# EAGLE schematic Motor Driver Board (EAGLE 9.3.2)
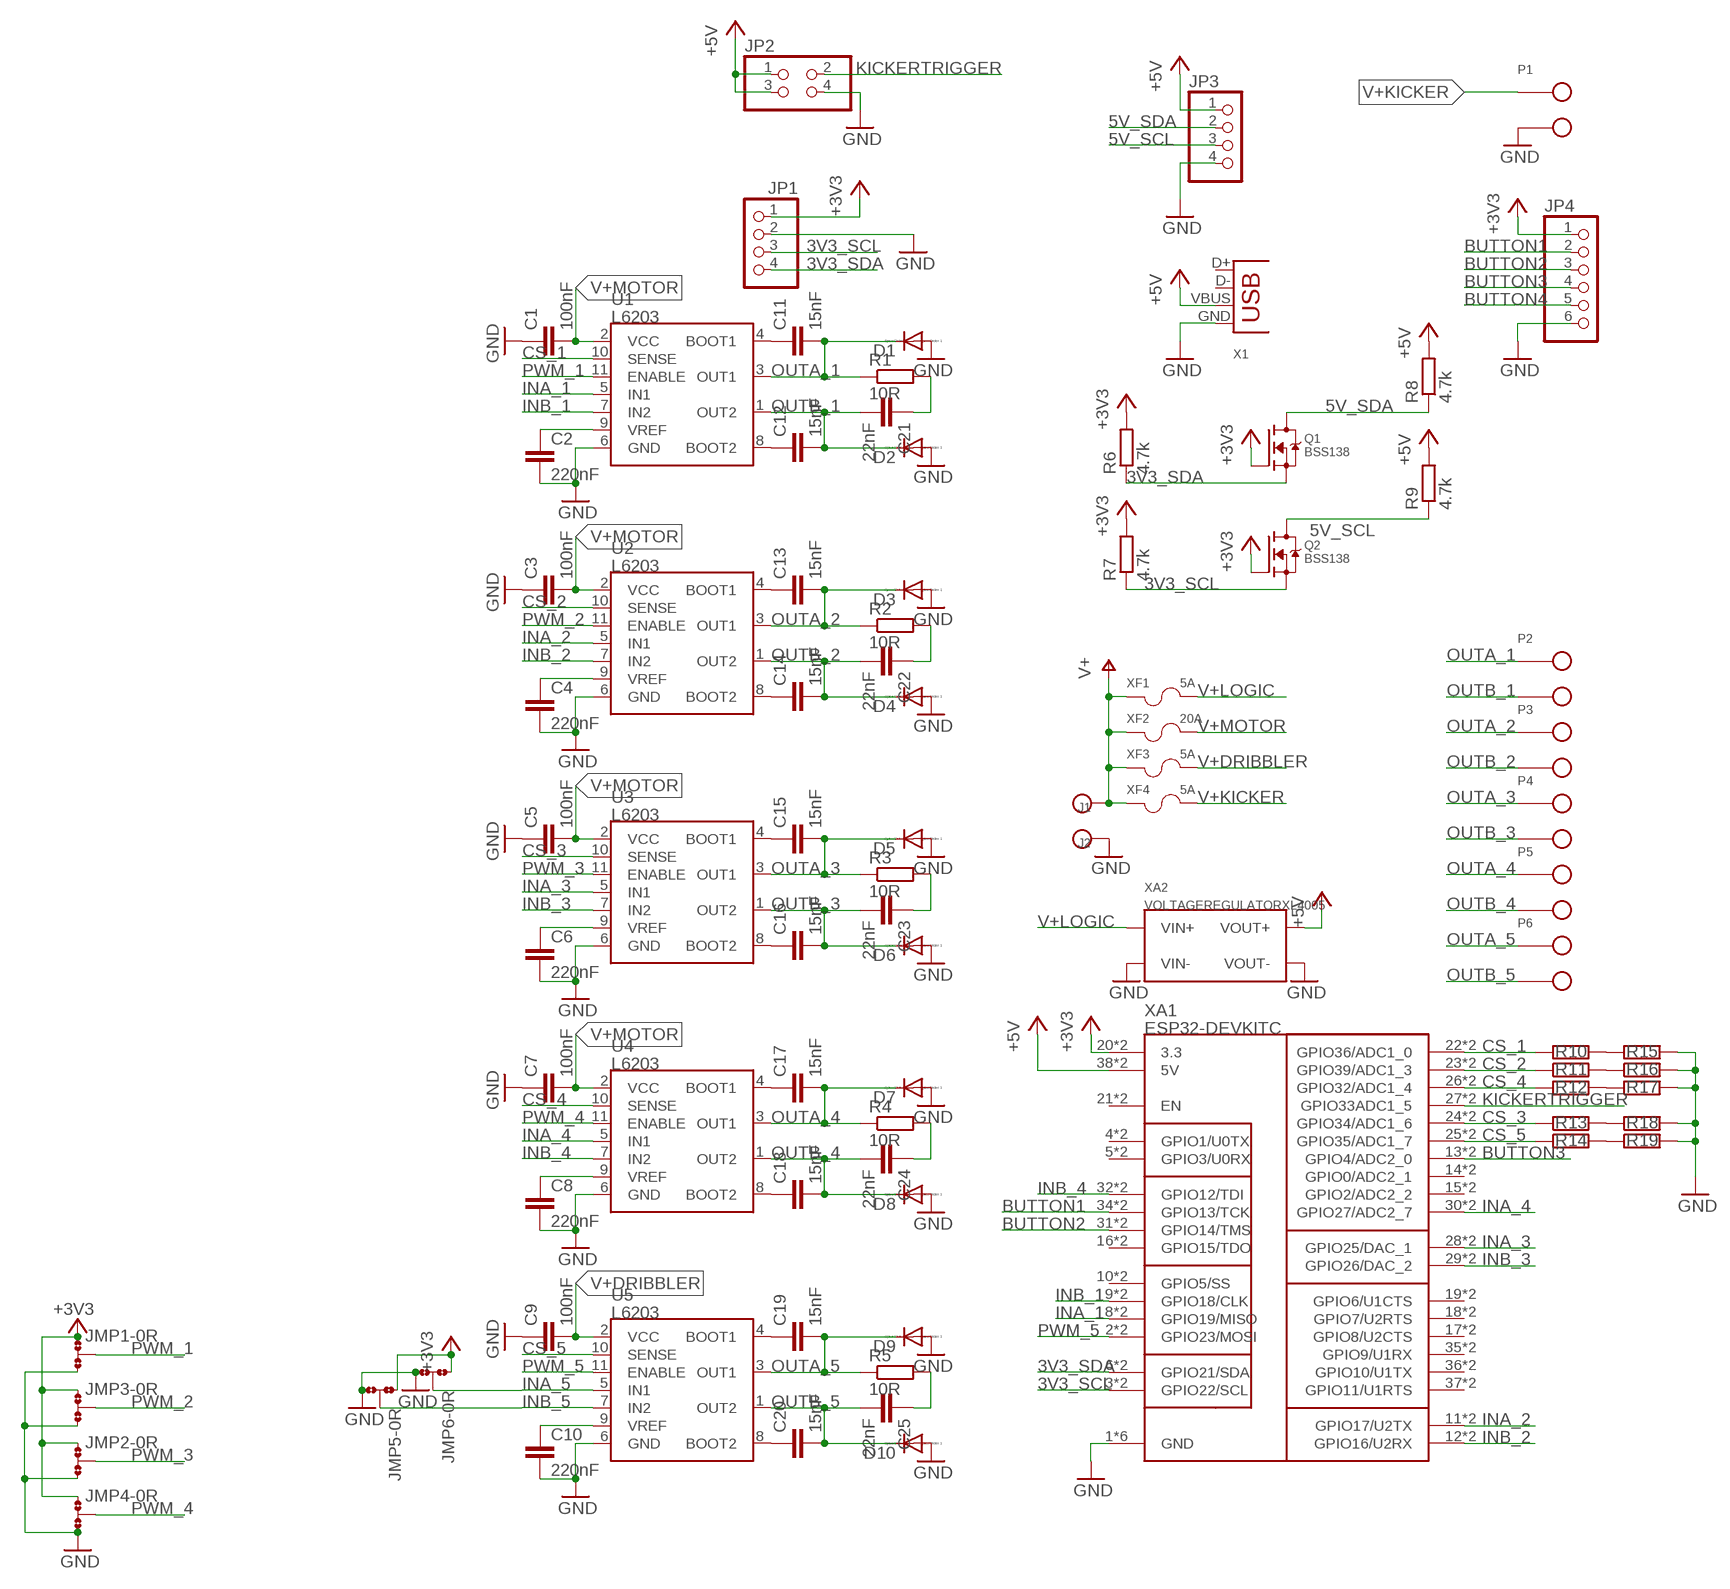
[diagram p0: schematic, sheet 1]

## Parts
C1  100nF  C-EUC0805  [C0805]
C2  220nF  C-EUC0805  [C0805]
C3  100nF  C-EUC0805  [C0805]
C4  220nF  C-EUC0805  [C0805]
C5  100nF  C-EUC0805  [C0805]
C6  220nF  C-EUC0805  [C0805]
C7  100nF  C-EUC0805  [C0805]
C8  220nF  C-EUC0805  [C0805]
C9  100nF  C-EUC0805  [C0805]
C10  220nF  C-EUC0805  [C0805]
C11  15nF  C-EUC0805  [C0805]
C12  15nF  C-EUC0805  [C0805]
C13  15nF  C-EUC0805  [C0805]
C14  15nF  C-EUC0805  [C0805]
C15  15nF  C-EUC0805  [C0805]
C16  15nF  C-EUC0805  [C0805]
C17  15nF  C-EUC0805  [C0805]
C18  15nF  C-EUC0805  [C0805]
C19  15nF  C-EUC0805  [C0805]
C20  15nF  C-EUC0805  [C0805]
C21  22nF  C-EUC0805  [C0805]
C22  22nF  C-EUC0805  [C0805]
C23  22nF  C-EUC0805  [C0805]
C24  22nF  C-EUC0805  [C0805]
C25  22nF  C-EUC0805  [C0805]
D1  DIODE-DO214AA  [DO214AA]
D2  DIODE-DO214AA  [DO214AA]
D3  DIODE-DO214AA  [DO214AA]
D4  DIODE-DO214AA  [DO214AA]
D5  DIODE-DO214AA  [DO214AA]
D6  DIODE-DO214AA  [DO214AA]
D7  DIODE-DO214AA  [DO214AA]
D8  DIODE-DO214AA  [DO214AA]
D9  DIODE-DO214AA  [DO214AA]
D10  DIODE-DO214AA  [DO214AA]
J1  MOLEXQUICKCONNECT  [MOLEXQUICKCONNECT]
J2  MOLEXQUICKCONNECT  [MOLEXQUICKCONNECT]
JMP1  0R-JUMPA  [A0R-JMP]
JMP2  0R-JUMPA  [A0R-JMP]
JMP3  0R-JUMPA  [A0R-JMP]
JMP4  0R-JUMPA  [A0R-JMP]
JMP5  0R-JUMPA  [A0R-JMP]
JMP6  0R-JUMPA  [A0R-JMP]
JP1  PINHD-1X4  [1X04]
JP2  PINHD-2X2  [2X02]
JP3  PINHD-1X4  [1X04]
JP4  PINHD-1X6  [1X06]
P1  TERMINALBLOCK0.15"  [TERMINALBLOCK0.15"]
P2  TERMINALBLOCK0.15"  [TERMINALBLOCK0.15"]
P3  TERMINALBLOCK0.15"  [TERMINALBLOCK0.15"]
P4  TERMINALBLOCK0.15"  [TERMINALBLOCK0.15"]
P5  TERMINALBLOCK0.15"  [TERMINALBLOCK0.15"]
P6  TERMINALBLOCK0.15"  [TERMINALBLOCK0.15"]
Q1  BSS138  [SOT95P240X120-3N]
Q2  BSS138  [SOT95P240X120-3N]
R1  10R  R-EU_R0805  [R0805]
R2  10R  R-EU_R0805  [R0805]
R3  10R  R-EU_R0805  [R0805]
R4  10R  R-EU_R0805  [R0805]
R5  10R  R-EU_R0805  [R0805]
R6  4.7k  R-EU_R0805  [R0805]
R7  4.7k  R-EU_R0805  [R0805]
R8  4.7k  R-EU_R0805  [R0805]
R9  4.7k  R-EU_R0805  [R0805]
R10  R-EU_R2512  [R2512]
R11  R-EU_R2512  [R2512]
R12  R-EU_R2512  [R2512]
R13  R-EU_R2512  [R2512]
R14  R-EU_R2512  [R2512]
R15  R-EU_R2512  [R2512]
R16  R-EU_R2512  [R2512]
R17  R-EU_R2512  [R2512]
R18  R-EU_R2512  [R2512]
R19  R-EU_R2512  [R2512]
U1  L6203  [MULTIWATT-11]
U2  L6203  [MULTIWATT-11]
U3  L6203  [MULTIWATT-11]
U4  L6203  [MULTIWATT-11]
U5  L6203  [MULTIWATT-11]
X1  USB-A-H  [USB-A-H]
XA1  ESP32-DEVKITC  [ESP32_DEVKITC]
XA2  VOLTAGEREGULATORXL4005  [XL4005PCB]
XF1  5A  FUSE  [MINIFUSEHOLDER]
XF2  20A  FUSE  [MINIFUSEHOLDER]
XF3  5A  FUSE  [MINIFUSEHOLDER]
XF4  5A  FUSE  [MINIFUSEHOLDER]

## Nets
3V3_SCL: JP1.3 Q2.2(S) R7.1 XA1.3(GPIO22/SCL) XA1.43(GPIO22/SCL)
3V3_SDA: JP1.4 Q1.2(S) R6.1 XA1.6(GPIO21/SDA) XA1.46(GPIO21/SDA)
5V_SCL: JP3.3 Q2.3(D) R9.1
5V_SDA: JP3.2 Q1.3(D) R8.1
+3V3: JMP1.1 JMP2.1 JMP3.1 JMP4.1 JMP5.1 JMP6.1 JP1.1 JP4.1 Q1.1(G) Q2.1(G) R6.2 R7.2 XA1.20(3.3) XA1.60(3.3)
+5V: JP2.1 JP2.3 JP3.1 R8.2 R9.2 X1.VBUS XA1.38(5V) XA1.78(5V) XA2.OUT+(VOUT+) XA2.OUT+THT(VOUT+)
ACSYNC_1: C21.1 R1.2
ACSYNC_2: C22.1 R2.2
ACSYNC_3: C23.1 R3.2
ACSYNC_4: C24.1 R4.2
ACSYNC_5: C25.1 R5.2
BOOTA_1: C11.1 U1.4(BOOT1)
BOOTA_2: C13.1 U2.4(BOOT1)
BOOTA_3: C15.1 U3.4(BOOT1)
BOOTA_4: C17.1 U4.4(BOOT1)
BOOTA_5: C19.1 U5.4(BOOT1)
BOOTB_1: C12.1 U1.8(BOOT2)
BOOTB_2: C14.1 U2.8(BOOT2)
BOOTB_3: C16.1 U3.8(BOOT2)
BOOTB_4: C18.1 U4.8(BOOT2)
BOOTB_5: C20.1 U5.8(BOOT2)
BUTTON1: JP4.2 XA1.34(GPIO13/TCK) XA1.74(GPIO13/TCK)
BUTTON2: JP4.3 XA1.31(GPIO14/TMS) XA1.71(GPIO14/TMS)
BUTTON3: JP4.4 XA1.13(GPIO4/ADC2_0) XA1.53(GPIO4/ADC2_0)
BUTTON4: JP4.5
CS_1: R10.1 U1.10(SENSE) XA1.22(GPIO36/ADC1_0) XA1.62(GPIO36/ADC1_0)
CS_2: R11.1 U2.10(SENSE) XA1.23(GPIO39/ADC1_3) XA1.63(GPIO39/ADC1_3)
CS_3: R13.1 U3.10(SENSE) XA1.24(GPIO34/ADC1_6) XA1.64(GPIO34/ADC1_6)
CS_4: R12.1 U4.10(SENSE) XA1.26(GPIO32/ADC1_4) XA1.66(GPIO32/ADC1_4)
CS_5: R14.1 U5.10(SENSE) XA1.25(GPIO35/ADC1_7) XA1.65(GPIO35/ADC1_7)
GND: C1.1 C2.2 C3.1 C4.2 C5.1 C6.2 C7.1 C8.2 C9.1 C10.2 D1.A D2.A D3.A D4.A D5.A D6.A D7.A D8.A D9.A D10.A J2.P$1 J2.P$3 J2.P$4 JMP1.3 JMP2.3 JMP3.3 JMP4.3 JMP5.3 JMP6.3 JP1.2 JP2.4 JP3.4 JP4.6 P1.P$2(PIN2) R15.2 R16.2 R17.2 R18.2 R19.2 U1.6(GND) U2.6(GND) U3.6(GND) U4.6(GND) U5.6(GND) X1.GND XA1.1(GND) XA1.7(GND) XA1.33(GND) XA1.41(GND) XA1.47(GND) XA1.73(GND) XA2.IN-(VIN-) XA2.IN-THT(VIN-) XA2.OUT-(VOUT-) XA2.OUT-THT(VOUT-)
INA_1: U1.5(IN1) XA1.8(GPIO19/MISO) XA1.48(GPIO19/MISO)
INA_2: U2.5(IN1) XA1.11(GPIO17/U2TX) XA1.51(GPIO17/U2TX)
INA_3: U3.5(IN1) XA1.28(GPIO25/DAC_1) XA1.68(GPIO25/DAC_1)
INA_4: U4.5(IN1) XA1.30(GPIO27/ADC2_7) XA1.70(GPIO27/ADC2_7)
INA_5: JMP6.2 U5.5(IN1)
INB_1: U1.7(IN2) XA1.9(GPIO18/CLK) XA1.49(GPIO18/CLK)
INB_2: U2.7(IN2) XA1.12(GPIO16/U2RX) XA1.52(GPIO16/U2RX)
INB_3: U3.7(IN2) XA1.29(GPIO26/DAC_2) XA1.69(GPIO26/DAC_2)
INB_4: U4.7(IN2) XA1.32(GPIO12/TDI) XA1.72(GPIO12/TDI)
INB_5: JMP5.2 U5.7(IN2)
KICKERTRIGGER: JP2.2 XA1.27(GPIO33ADC1_5) XA1.67(GPIO33ADC1_5)
N$1: R10.2 R15.1
N$2: R11.2 R16.1
N$3: R12.2 R17.1
N$4: R13.2 R18.1
N$5: R14.2 R19.1
OUTA_1: C11.2 D1.C P2.P$1(PIN1) R1.1 U1.3(OUT1)
OUTA_2: C13.2 D3.C P3.P$1(PIN1) R2.1 U2.3(OUT1)
OUTA_3: C15.2 D5.C P4.P$1(PIN1) R3.1 U3.3(OUT1)
OUTA_4: C17.2 D7.C P5.P$1(PIN1) R4.1 U4.3(OUT1)
OUTA_5: C19.2 D9.C P6.P$1(PIN1) R5.1 U5.3(OUT1)
OUTB_1: C12.2 C21.2 D2.C P2.P$2(PIN2) U1.1(OUT2)
OUTB_2: C14.2 C22.2 D4.C P3.P$2(PIN2) U2.1(OUT2)
OUTB_3: C16.2 C23.2 D6.C P4.P$2(PIN2) U3.1(OUT2)
OUTB_4: C18.2 C24.2 D8.C P5.P$2(PIN2) U4.1(OUT2)
OUTB_5: C20.2 C25.2 D10.C P6.P$2(PIN2) U5.1(OUT2)
PWM_1: JMP1.2 U1.11(ENABLE)
PWM_2: JMP3.2 U2.11(ENABLE)
PWM_3: JMP2.2 U3.11(ENABLE)
PWM_4: JMP4.2 U4.11(ENABLE)
PWM_5: U5.11(ENABLE) XA1.2(GPIO23/MOSI) XA1.42(GPIO23/MOSI)
V+: J1.P$1 J1.P$3 J1.P$4 XF1.P$1 XF1.P$2 XF2.P$1 XF2.P$2 XF3.P$1 XF3.P$2 XF4.P$1 XF4.P$2
V+DRIBBLER: C9.2 U5.2(VCC) XF3.P$3 XF3.P$4
V+KICKER: P1.P$1(PIN1) XF4.P$3 XF4.P$4
V+LOGIC: XA2.IN+(VIN+) XA2.IN+THT(VIN+) XF1.P$3 XF1.P$4
V+MOTOR: C1.2 C3.2 C5.2 C7.2 U1.2(VCC) U2.2(VCC) U3.2(VCC) U4.2(VCC) XF2.P$3 XF2.P$4
VREF_1: C2.1 U1.9(VREF)
VREF_2: C4.1 U2.9(VREF)
VREF_3: C6.1 U3.9(VREF)
VREF_4: C8.1 U4.9(VREF)
VREF_5: C10.1 U5.9(VREF)
Unconnected: X1.D+ X1.D- XA1.4(GPIO1/U0TX) XA1.5(GPIO3/U0RX) XA1.10(GPIO5/SS) XA1.14(GPIO0/ADC2_1) XA1.15(GPIO2/ADC2_2) XA1.16(GPIO15/TDO) XA1.17(GPIO8/U2CTS) XA1.18(GPIO7/U2RTS) XA1.19(GPIO6/U1CTS) XA1.21(EN) XA1.35(GPIO9/U1RX) XA1.36(GPIO10/U1TX) XA1.37(GPIO11/U1RTS) XA1.44(GPIO1/U0TX) XA1.45(GPIO3/U0RX) XA1.50(GPIO5/SS) XA1.54(GPIO0/ADC2_1) XA1.55(GPIO2/ADC2_2) XA1.56(GPIO15/TDO) XA1.57(GPIO8/U2CTS) XA1.58(GPIO7/U2RTS) XA1.59(GPIO6/U1CTS) XA1.61(EN) XA1.75(GPIO9/U1RX) XA1.76(GPIO10/U1TX) XA1.77(GPIO11/U1RTS)

## Library data of the parts
C1-C25 = rcl:C-EU: CAPACITOR, European symbol; SPICEPREFIX: C
D1-D10 = diode:DIODE-: DIODE
J1 J2 = Robocup:MOLEXQUICKCONNECT
JMP1-JMP6 = jump-0r-smd:0R-JUMP: SMD 0R 0805 Jumper
JP1 JP3 = pinhead:PINHD-1X4: PIN HEADER
JP2 = pinhead:PINHD-2X2: PIN HEADER
JP4 = pinhead:PINHD-1X6: PIN HEADER
P1-P6 = Robocup:TERMINALBLOCK0.15"
Q1 Q2 = Robocup:BSS138: MOSFET N-Channel 50V 0.22A SOT23 Fairchild BSS138 N-channel MOSFET Transistor, 0.22 A, 50 V, 3-Pin SOT-23 Source: Datasheet <http://docs-europe.electrocomponents.com/webdocs/0d22/0900766b80d22ec5.pdf>; ARROW_PART_NUMBER: BSS138; ARROW_PRICE/STOCK: http://uk.rs-online.com/web/p/products/1241694; DESCRIPTION: MOSFET N-Channel 50V 0.22A SOT23 Fairchild BSS138 N-channel MOSFET Transistor, 0.22 A, 50 V, 3-Pin SOT-23; HEIGHT: 1.2mm; MANUFACTURER_NAME: Fairchild Semiconductor; MANUFACTURER_PART_NUMBER: BSS138; RS_PART_NUMBER: 1241694; RS_PRICE/STOCK: http://uk.rs-online.com/web/p/products/1241694
R1-R19 = rcl:R-EU_: RESISTOR, European symbol; SPICEPREFIX: R
U1-U5 = Robocup:L6203
X1 = Robocup:USB: USB Connectors
XA1 = Robocup:ESP32-DEVKITC: WiFi / 802.11 Development Tools ESP32 General Development Kit, ESP-WROOM-32 on the board Source: Datasheet <http://esp-idf.readthedocs.io/en/latest/get-started/get-started-devkitc.html>
XA2 = Robocup:VOLTAGEREGULATOR
XF1-XF4 = Robocup:FUSE

## Net classes
0 default: width 0.203 mm